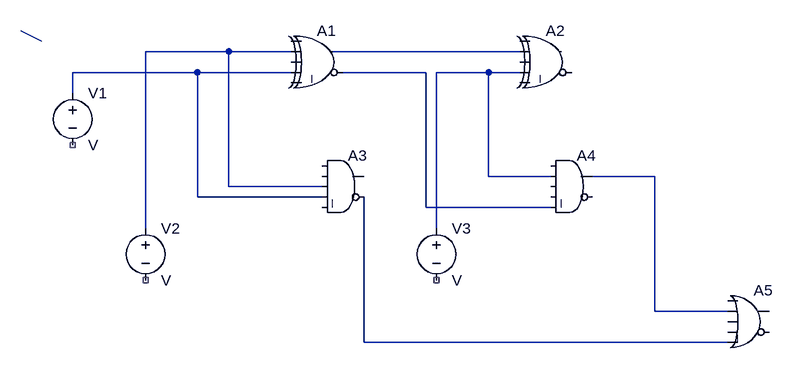
[diagram p0: schematic Full_Adder_Digital.asc]
Full_Adder_Digital.asc, the LTspice schematic file:
Version 4.1
SHEET 1 1128 680
WIRE 288 16 160 16
WIRE 384 16 288 16
WIRE 736 16 448 16
WIRE 240 48 48 48
WIRE 384 48 240 48
WIRE 592 48 464 48
WIRE 688 48 608 48
WIRE 736 48 688 48
WIRE 48 80 48 48
WIRE 688 208 688 48
WIRE 784 208 688 208
WIRE 944 208 848 208
WIRE 288 224 288 16
WIRE 432 224 288 224
WIRE 240 240 240 48
WIRE 432 240 240 240
WIRE 592 256 592 48
WIRE 784 256 592 256
WIRE 160 288 160 16
WIRE 608 288 608 48
WIRE 944 416 944 208
WIRE 1056 416 944 416
WIRE 496 464 496 240
WIRE 1056 464 496 464
WIRE -32 -16 0 0
SYMBOL voltage 48 64 R0
SYMATTR InstName V1
SYMBOL voltage 160 272 R0
SYMATTR InstName V2
SYMBOL Digital\\xor 432 -32 R0
SYMATTR InstName A1
SYMBOL Digital\\xor 784 -32 R0
SYMATTR InstName A2
SYMBOL Digital\\and 464 160 R0
SYMATTR InstName A3
SYMBOL Digital\\and 816 160 R0
SYMATTR InstName A4
SYMBOL voltage 608 272 R0
SYMATTR InstName V3
SYMBOL Digital\\or 1088 368 R0
SYMATTR InstName A5

The netlist it stands for:
* Full_Adder_Digital.asc
V1 N003 NC_01 V
V2 N001 NC_02 V
A1 0 N001 0 N003 0 N004 N002 0 XOR
A2 0 N002 0 N005 0 0 0 0 XOR
A3 0 0 N001 N003 0 N007 0 0 AND
A4 0 N005 0 0 N004 0 N006 0 AND
V3 N005 NC_03 V
A5 0 N006 0 0 N007 0 0 0 OR
.backanno
.end